# Altium schematic sheet power supply.SchDoc
size A3; SheetNumber: 15; SheetTotal: 15
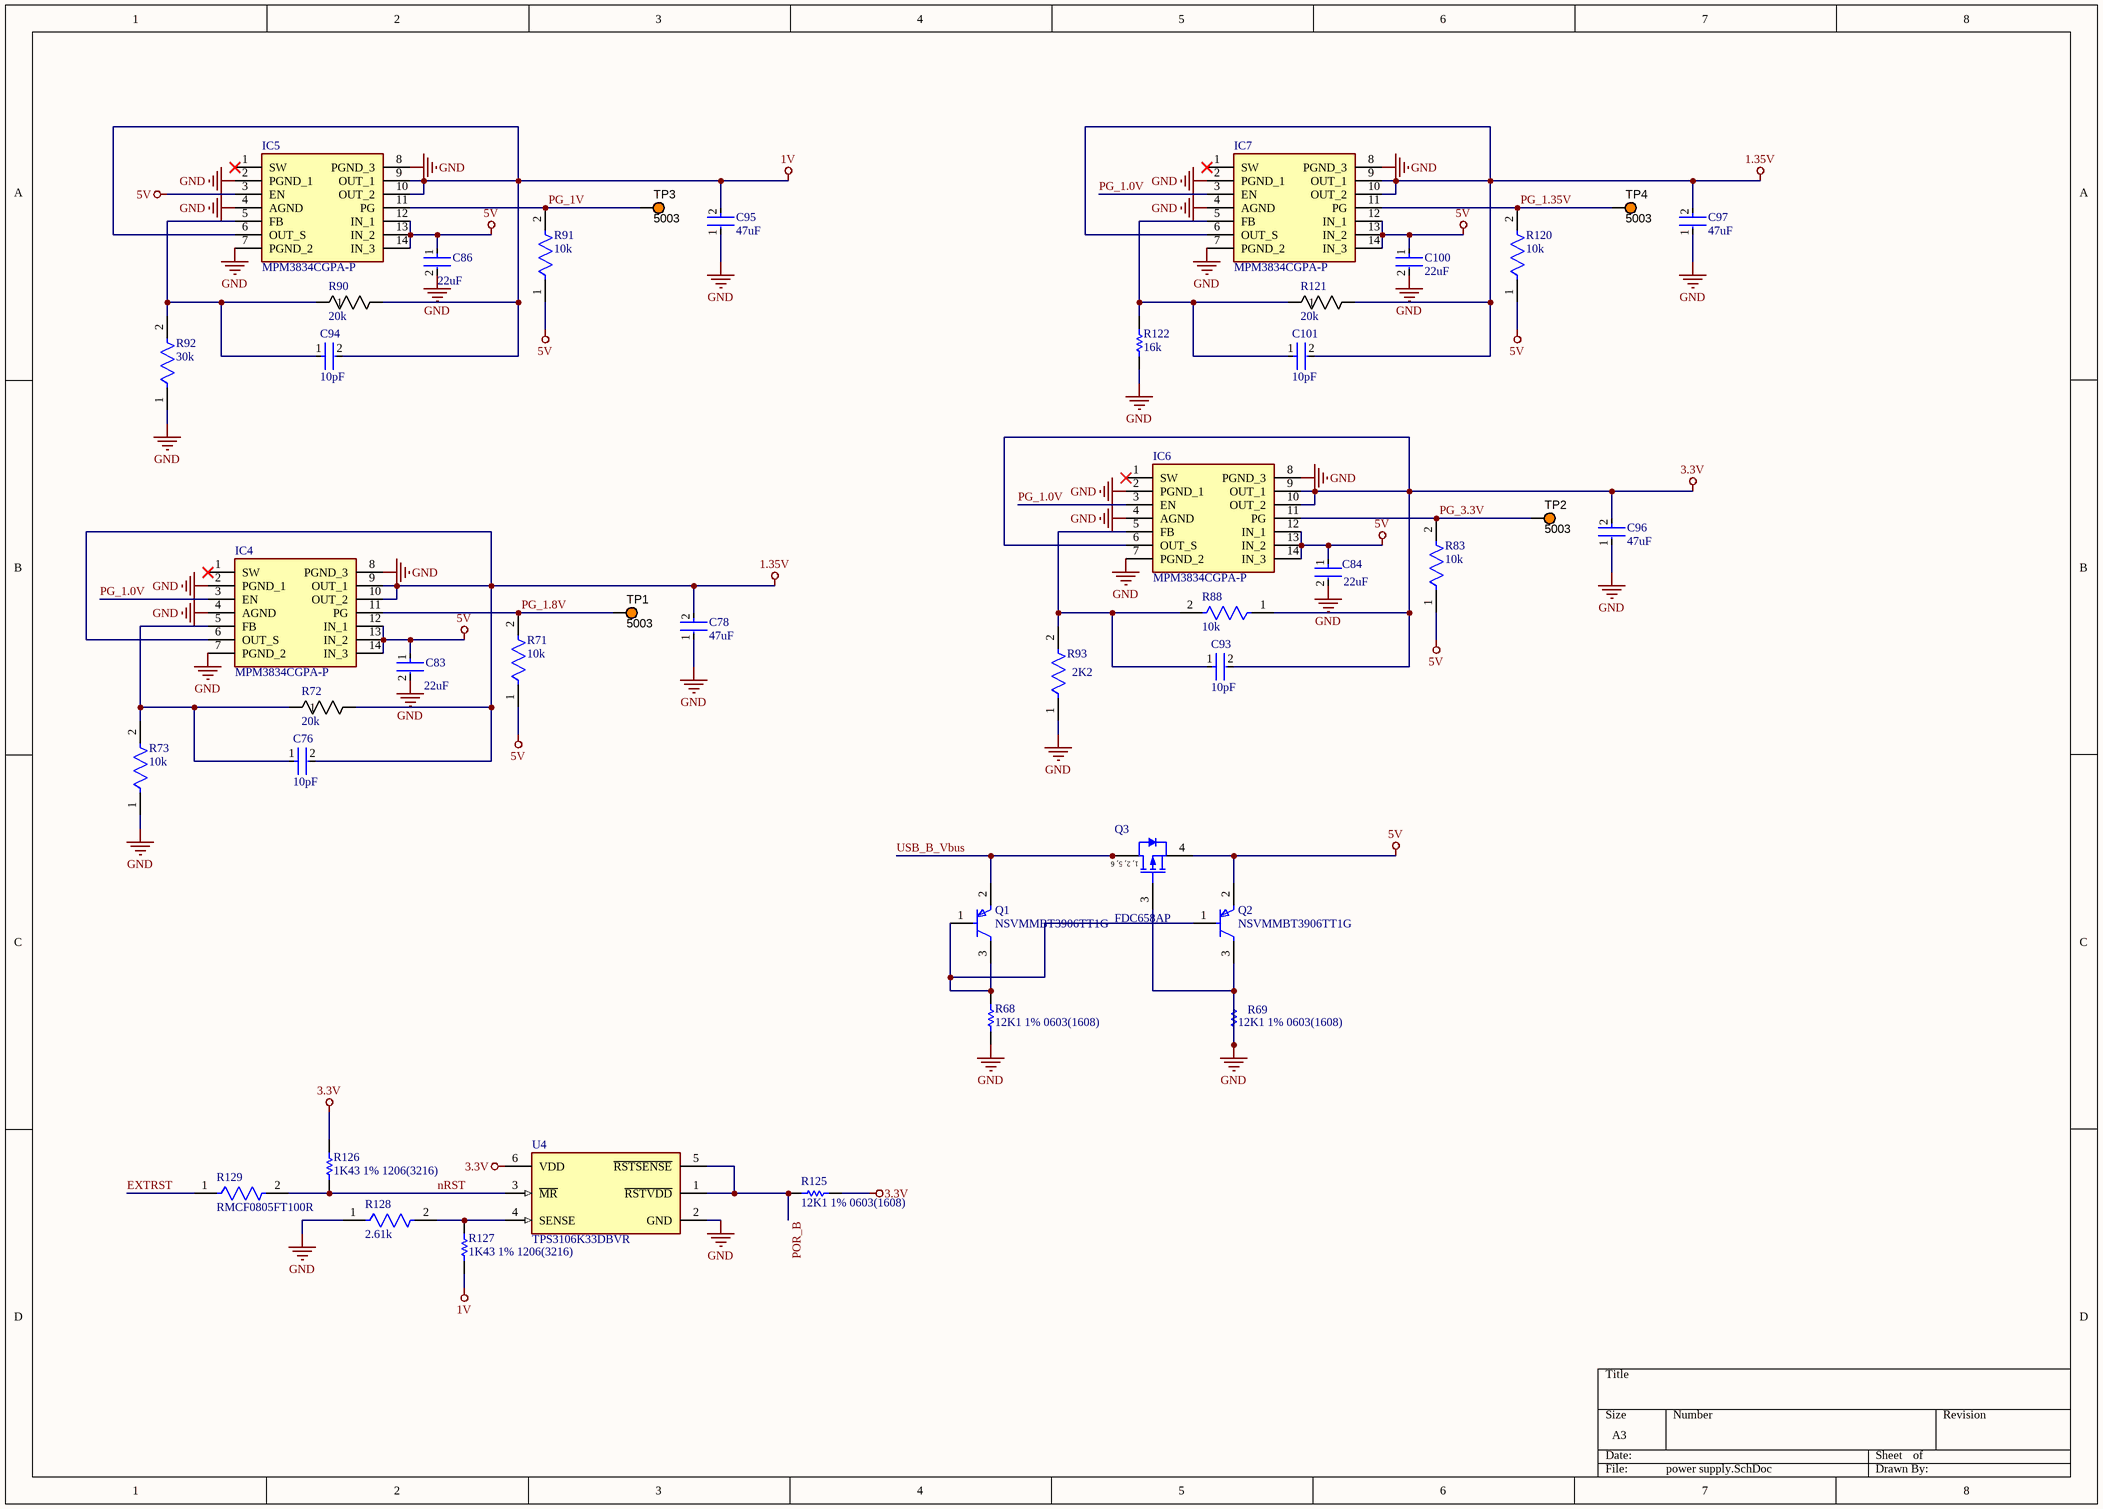
[diagram p0: power supply.SchDoc]

## Parts
C76  10pF  [FP-0603-L_1_6_0_15-W_0_81-IPC_B]
C78  47uF  [FP-GRM31C-0_3-e0_3_0_8-IPC_C]
C83  22uF  [FP-GRMJN7-0_1-IPC_C]
C84  22uF  [FP-GRMJN7-0_1-IPC_C]
C86  22uF  [FP-GRMJN7-0_1-IPC_C]
C93  10pF  [FP-0603-L_1_6_0_15-W_0_81-IPC_B]
C94  10pF  [FP-0603-L_1_6_0_15-W_0_81-IPC_B]
C95  47uF  [FP-GRM31C-0_3-e0_3_0_8-IPC_C]
C96  47uF  [FP-GRM31C-0_3-e0_3_0_8-IPC_C]
C97  47uF  [FP-GRM31C-0_3-e0_3_0_8-IPC_C]
C100  22uF  [FP-GRMJN7-0_1-IPC_C]
C101  10pF  [FP-0603-L_1_6_0_15-W_0_81-IPC_B]
IC4  MPM3834CGPA-P  [MPM3834CGPAP]
IC5  MPM3834CGPA-P  [MPM3834CGPAP]
IC6  MPM3834CGPA-P  [MPM3834CGPAP]
IC7  MPM3834CGPA-P  [MPM3834CGPAP]
Q1  NSVMMBT3906TT1G  [FP-463-01-MFG]
Q2  NSVMMBT3906TT1G  [FP-463-01-MFG]
Q3  FDC658AP  [FAIR-SOT23-6_V]
R68  12K1 1% 0603(1608)  [RESC0603(1608)_M]
R69  12K1 1% 0603(1608)  [RESC0603(1608)_M]
R71  10k  [FP-RN73R2A-IPC_A]
R72  20k  [RES_RCC0402_VIS]
R73  10k  [FP-RN73R2A-IPC_A]
R83  10k  [FP-RN73R2A-IPC_A]
R88  10k  [FP-RN73R2A-IPC_A]
R90  20k  [RES_RCC0402_VIS]
R91  10k  [FP-RN73R2A-IPC_A]
R92  30k  [FP-RMCF0603-IPC_A]
R93  2K2  [FP-LTR10-IPC_B]
R120  10k  [FP-RN73R2A-IPC_A]
R121  20k  [RES_RCC0402_VIS]
R122  16k  [RESC0603X28X15LL05T05]
R125  12K1 1% 0603(1608)  [RESC0603(1608)_M]
R126  1K43 1% 1206(3216)  [RESC1206(3216)_M]
R127  1K43 1% 1206(3216)  [RESC1206(3216)_M]
R128  2.61k  [FP-RK73H1J-IPC_B]
R129  RMCF0805FT100R  [FP-RMCF0805-IPC_A]
TP1  5003  [KSTN-5003]
TP2  5003  [KSTN-5003]
TP3  5003  [KSTN-5003]
TP4  5003  [KSTN-5003]
U4  TPS3106K33DBVR  [FP-DBV0006A-MFG]

## Nets
1.35V: C76.2 C78.2 C97.2 C101.2 IC4.6(OUT_S) IC4.9(OUT_1) IC4.10(OUT_2) IC7.6(OUT_S) IC7.9(OUT_1) IC7.10(OUT_2) R72.2 R121.2
1V: C94.2 C95.2 IC5.6(OUT_S) IC5.9(OUT_1) IC5.10(OUT_2) R90.2 R127.1
3.3V: C93.2 C96.2 IC6.6(OUT_S) IC6.9(OUT_1) IC6.10(OUT_2) R88.1 R125.1 R126.2 U4.6(VDD)
5V: C83.1 C84.1 C86.1 C100.1 IC4.12(IN_1) IC4.13(IN_2) IC4.14(IN_3) IC5.3(EN) IC5.12(IN_1) IC5.13(IN_2) IC5.14(IN_3) IC6.12(IN_1) IC6.13(IN_2) IC6.14(IN_3) IC7.12(IN_1) IC7.13(IN_2) IC7.14(IN_3) Q2.2(E) Q3.4(SOURCE) R71.1 R83.1 R91.1 R120.1
GND: C78.1 C83.2 C84.2 C86.2 C95.1 C96.1 C97.1 C100.2 IC4.2(PGND_1) IC4.4(AGND) IC4.7(PGND_2) IC4.8(PGND_3) IC5.2(PGND_1) IC5.4(AGND) IC5.7(PGND_2) IC5.8(PGND_3) IC6.2(PGND_1) IC6.4(AGND) IC6.7(PGND_2) IC6.8(PGND_3) IC7.2(PGND_1) IC7.4(AGND) IC7.7(PGND_2) IC7.8(PGND_3) Q2.3(C) Q3.3(GATE) R68.1 R69.1 R69.2 R73.1 R92.1 R93.1 R122.1 R128.1 U4.2(GND)
 PG_1.8V: IC4.11(PG) R71.2 TP1.1
 PG_1.35V: IC7.11(PG) R120.2 TP4.1
 PG_1V: IC5.11(PG) R91.2 TP3.1
 PG_3.3V: IC6.11(PG) R83.2 TP2.1
EXTRST: R129.1
nRST: R126.1 R129.2 U4.3(~{MR})
PG_1.0V: IC4.3(EN) IC6.3(EN) IC7.3(EN)
POR_B: R125.2 U4.1(~{RSTVDD}) U4.5(~{RSTSENSE})
USB_B_Vbus: Q1.2(E) Q3.1(DRAIN) Q3.2(DRAIN) Q3.5(DRAIN) Q3.6(DRAIN)
NetC76_1: C76.1 IC4.5(FB) R72.1 R73.2
NetC93_1: C93.1 IC6.5(FB) R88.2 R93.2
NetC94_1: C94.1 IC5.5(FB) R90.1 R92.2
NetC101_1: C101.1 IC7.5(FB) R121.1 R122.2
NetQ1_1: Q1.1(B) Q1.3(C) Q2.1(B) R68.2
NetR127_2: R127.2 R128.2 U4.4(SENSE)

Not connected (* = marked no-connect by the designer): IC4 1(SW)*; IC5 1(SW)*; IC6 1(SW)*; IC7 1(SW)*

## Notes on the sheet
- (in symbol CMP-2000-06244-1) 1, 2, 5, 6

## Library data of the parts
C76 C93 C94 C101 = CMP-04427-018082-1: General Purpose Ceramic Capacitor, 0603, 10pF, 2%, NP0, 30ppm/°C, 100V; Dielectric: C0G; Package Quantity: 1; Case/Package: 0603; Mount: Surface Mount; Length: 0.063inch; Voltage Rating (DC): 100V; Lead Free: Lead Free; Termination: SMD/SMT; Thickness: 0.035inch; Capacitance: 10pF; Voltage Rating: 100V; Tolerance: 2%; Case Code (Metric): 1608; Max Operating Temperature: 125°C; Height: 860um; Width: 0.032inch; Case Code (Imperial): 0603; Min Operating Temperature: -55°C; Construction: Flat; Number of Pins: 2; Series: -; Packaging: Tape and Reel; RoHS Compliant: Yes
C78 C95-C97 = CMP-06035-011430-1: Chip Multilayer Ceramic Capacitors for General Purpose, 1206, 47uF, X5R, 15%, 20%, 16V; Capacitance: 47uF; Length: 3.2mm; Thickness: 1.6mm; Width: 1.6mm; Voltage Rating (DC): 16V; Tolerance: 20%; Dielectric: X5R
C83 C84 C86 C100 = CMP-06035-032253-1: Chip Multilayer Ceramic Capacitors for General Purpose, 0704, 22uF, X5R, 15%, 20%, 16V
IC4-IC7 = MPM3834CGPA-P: Integrated Circuit; Manufacturer_Name: Monolithic Power Systems (MPS); Datasheet Link: https://www.monolithicpower.com/en/documentview/productdocument/index/version/2/document_type/Datasheet/lang/en/sku/MPM3834CGPA/document_id/9651/; Height: 1.31mm; Manufacturer_Part_Number: MPM3834CGPA-P; Mouser Part Number: 946-MPM3834CGPA-P; Mouser Price/Stock: https://www.mouser.co.uk/ProductDetail/Monolithic-Power-Systems-MPS/MPM3834CGPA-P?qs=By6Nw2ByBD1gcNTTHPVSOg%3D%3D
Q1 Q2 = CMP-00278-57605538-1: NSVMMBT3906TT1G Small Signal Bipolar Transistor, 0.2A I(C), 40V V(BR)CEO, 1-Element, PNP, Silicon; Manufacturer Lifecycle Status: ACTIVE; Collector Emitter Voltage (VCEO): 400mV; Transition Frequency: 250MHz; Max Collector Current: 200mA; Max Power Dissipation: 200mW; NexarPartId: 57605538; Packaging: Tape & Reel (TR); Lead Free: Lead Free; Lifecycle Status: Production; Collector Emitter Breakdown Voltage: 40V; Mount: Surface Mount; RoHS: Compliant
Q3 = CMP-2000-06244-1: Single P-Channel Logic Level PowerTrench(R) MOSFET, -30 V, -4 A, -55 to 150 degC, 6-Pin SOT23, RoHS, Tape and Reel; Manufacturer: Fairchild Semiconductor; Drain-to-Source Voltage [Vdss]: 30V; Qg Gate Charge: 8.1nC; Rated Power Dissipation: 0.8W; Package Version: Rev. 5, 05/2015; Drain-Source On Resistance-Max: 50mO; Datasheet Version: Rev. B1, 11/2011; Channel Type: P-Channel; Package URL: https://www.fairchildsemi.com/package-drawings/MA/MA06A.pdf; Datasheet URL: https://datasheet.ciiva.com/15137/getdatasheetpartid-92299-15137737.pdf; Package Description: 6-Pin Small Outline Transistor, Body 2.9 x 1.6 mm, Pitch 0.95 mm; Mounting Technology: SurfaceMount; Manufacturer URL: https://www.fairchildsemi.com/; Package Reference: SOT23-6
R68 R69 R125 = CMP-1012-00632-1: 12K1 0.1W 1% 0603 (1608 Metric)  SMD; Case-Metric: 1608; Case-EIA: 0603; Value: 12100.00 Ohm; Power: 0.1 W; Technology: SMT; Tolerance: 1 %
R71 R73 R83 R88 R91 R120 = CMP-04015-052084-1: RES 10K OHM 0.1% 1/8W 0805
R72 R90 R121 = CMP-05494-108190669-1: RCC040220K0FKED Res Thick Film 0402 20K Ohm 1% 0.125W(1/8W) ±100ppm/°C Pad SMD Automotive T/R; Schedule B: 8533210045; NexarPartId: 108190669
R92 = CMP-26527-002251-1: 30kΩ ±5% 0.1W 0603 Thick Film Chip Resistor AEC-Q200 compliant; Max Power Dissipation: 100mW; Temperature Coefficient: 200ppm/°C; Resistance: 30kR; Width: 0.031inch; Series: RMCF; Resistor Type: Thick Film; Number of Terminations: 2; Max Operating Temperature: 155°C; Length: 0.061inch; Contact Plating: Tin; Case/Package: 0603; Height: 0.022inch; Tolerance: 5%; Min Operating Temperature: -55°C; Mount: Surface Mount; Packaging: Tape and Reel; RoHS Compliant: Yes; Features: Automotive AEC-Q200; Radiation Hardening: No
R93 = CMP-08839-030356-1: High power chip resistors wide terminal type 2.2kΩ 5% 0.25W 0508; Max Power Dissipation: 250mW; Resistance: 2.2kR; Temperature Coefficient: 200ppm/°C; Tolerance: 5%; Series: LTR; Height: 0.026inch; Case Code (Metric): 2012; Features: Automotive AEC-Q200; Max Operating Temperature: 155°C; Packaging: Tape and Reel; Min Operating Temperature: -55°C; Case/Package: 0805; Resistor Type: Thick Film; Number of Terminations: 2; Width: 0.079inch; Length: 0.047inch; Case Code (Imperial): 0805; Package Quantity: 1
R122 = CMP-2004-00154-1: Part Number: CRCW020116K0JNED; Manufacturer: Vishay Dale
R126 R127 = CMP-1014-00526-1: 1K43 0.25W 1% 1206 (3216 Metric)  SMD; Value: 1430.00 Ohm; Case-EIA: 1206; Case-Metric: 3216; Power: 0.25 W; Technology: SMT; Tolerance: 1 %
R128 = CMP-04015-095862-1: 2.61kΩ ±0.5% 0.1W Chip Resistor 0603 Thick Film AEC-Q200 Qualified
R129 = CMP-26527-001731-1: 100Ω ±1% 0.125W 0805 Thick Film Chip Resistor AEC-Q200 compliant; Power Rating: 250mW; Temperature Coefficient: 100ppm/°C; Resistance: 100R; Max Power Dissipation: 125mW; Radiation Hardening: No; RoHS Compliant: Yes; Case Code (Imperial): 0805; Depth: 1.25mm; Length: 2mm; Min Operating Temperature: -55°C; Series: RMCF; Packaging: Tape and Reel; Features: Automotive AEC-Q200; Height: 0.026inch; Size Code: 0805; Tolerance: 1%; Number of Terminations: 2; Max Operating Temperature: 155°C; Case/Package: 0805; Width: 0.049inch; Contact Plating: Tin; Resistor Type: Thick Film; Construction: Rectangular; Lead Free: Lead Free; Military Standard: Not; Case Code (Metric): 2012; Mount: Surface Mount
TP1-TP4 = CMP-1672-00009-1: Test Point, Orange, 1-Pin THD, RoHS; Peak Reverse Current: 600 uA; Forward Current: 3 A; Max Surge Current: 80 A; Forward Voltage: 1.08 V; Max Operating Temperature: 150 degC; PackageReference: 5003; Pins: 2; ComponentLink2URL: http://keyelco.com/userAssets/file/M65p56.pdf; PackageDescription: 1-Pin Through Hole Device, Dia 2.54 mm; Weight: 0.01 lb; Diameter: 5.3 mm; Mount: Through Hole; Package Quantity: 500; Packaging: Bulk; Min Operating Temperature: -65 degC; ComponentLink1Description: Manufacturer URL; Height: 0.25 inch; ComponentLink1URL: http://www.keyelco.com/; ComponentLink2Description: Datasheet; Width: 0.25 inch; REACH SVHC: No SVHC; RoHSCompliant: true; Radiation Hardening: No; Length: 9.5 mm; DatasheetVersion: Jun-15
U4 = CMP-04919-000013-1: IC SUPERVISORY CIRCUIT SOT-23-6; Manufacturer: Texas Instruments; Min Supply Voltage: 0.9V; Reset Type: Active Low; Max Junction Temp: +125°C; Reset Timeout: 130ms; Number Of Rails Monitored: 1; Threshold Voltage: 2.941V; Nominal Supply Current: 1.2-2uA; Standoff Height: 0mm; Max Supply Voltage: 3.6V; Number Of Outputs: 2; Temperature Range High: +85°C; Device Class L1: Integrated Circuits (ICs); Device Class L3: Voltage Supervisors; Automotive: No; Mouser Description: Supervisory Circuits Current/Supply-Volt Supervisory; Temperature: -40°C to +85°C; Lead Free: Yes; Height: 1.45mm; Category: IC; Octopart: https://octopart.com/tps3106k33dbvr-texas+instruments-505820; Device Class L2: Power Management ICs; RoHS: TRUE; Package: DBV0006A; ComponentLink2Description: Datasheet; ComponentLink2URL: http://www.ti.com/lit/ds/symlink/tps3106.pdf; Temperature Range Low: -40°C; Digikey Description: IC SUPERVISORY CIRCUIT SOT-23-6; Manufacturer Part Number: TPS3106K33DBVR; Ipc Land Pattern Name: SOT95P280X145-6